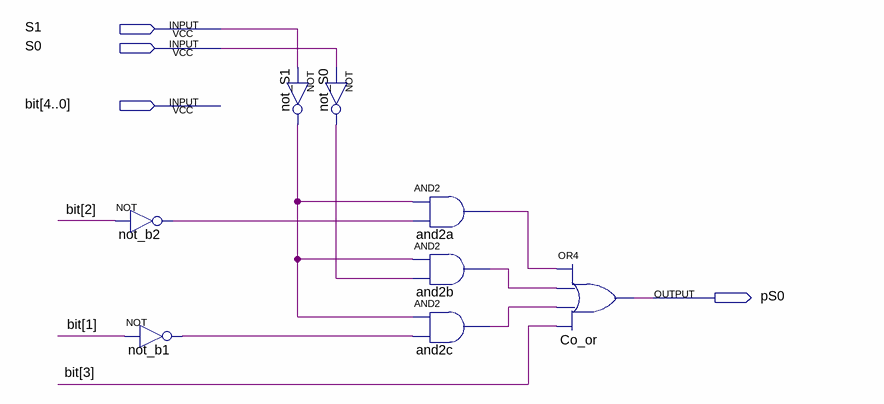
[diagram p0: schematic sheet]
// Quartus schematic prox_s0.bdf as structural Verilog: 8 symbols, 4 pins
module prox_s0 (
  input  S1,
  input  S0,
  input  [4:0] \bit ,
  output pS0
);

  wire and2a_out, and2b_out, and2c_out, not_b1_out, not_b2_out, not_S0_out, not_S1_out;

  not not_b2 (not_b2_out, \bit [2]);
  not not_b1 (not_b1_out, \bit [1]);
  not not_S1 (not_S1_out, S1);
  not not_S0 (not_S0_out, S0);
  and and2a (and2a_out, not_S1_out, not_b2_out);
  and and2b (and2b_out, not_S1_out, not_S0_out);
  and and2c (and2c_out, not_S1_out, not_b1_out);
  or Co_or (pS0, and2a_out, and2b_out, and2c_out, \bit [3]);
endmodule
